# EAGLE design ster_pnp_npn (EAGLE 4.13)
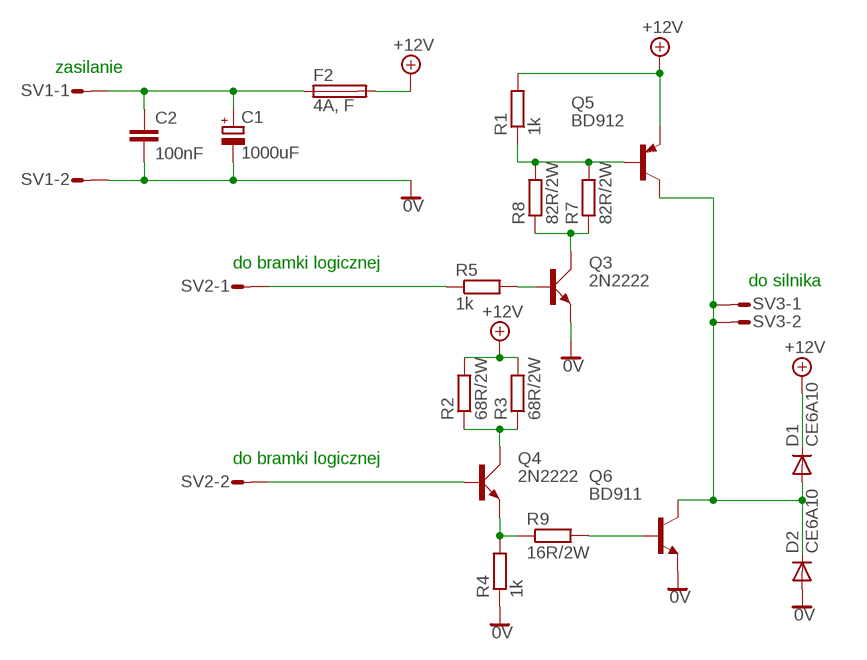
[diagram p0: schematic, sheet 1]

## Parts
C1  1000uF  CPOL-EUE3.5-10  [E3,5-10]
C2  100nF  C-EU050-025X075  [C050-025X075]
D1  CE6A10  BA296  [P2-15]
D2  CE6A10  BA296  [P2-15]
F2  4A, F  SH22  [SH22]
Q3  2N2222  [TO18A]
Q4  2N2222  [TO18A]
Q5  BD912  2N6107  [TO220]
Q6  BD911  2N6292  [TO220]
R1  1k  R-EU_0204/7  [0204/7]
R2  68R/2W  R-EU_0309/12  [0309/12]
R3  68R/2W  R-EU_0309/12  [0309/12]
R4  1k  R-EU_0204/7  [0204/7]
R5  1k  R-EU_0204/7  [0204/7]
R7  82R/2W  R-EU_0309/12  [0309/12]
R8  82R/2W  R-EU_0309/12  [0309/12]
R9  16R/2W  R-EU_0309/12  [0309/12]
SV1  L02P  [L02P]
SV2  L02P  [L02P]
SV3  L02P  [L02P]

## Nets
0V: C1.- C2.2 D2.A Q3.E Q6.3(E) R4.1 SV1.2
+12V: D1.C F2.2 Q5.3(E) R1.2 R2.2 R3.2
N$1: Q5.1(B) R1.1 R7.2 R8.2
N$2: Q3.C R7.1 R8.1
N$3: D1.A D2.C Q5.2(C) Q6.2(C) SV3.1 SV3.2
N$4: C1.+ C2.1 F2.1 SV1.1
N$5: Q4.E R4.2 R9.1
N$6: Q6.1(B) R9.2
N$7: R5.1 SV2.1
N$8: Q4.B SV2.2
N$9: Q3.B R5.2
N$10: Q4.C R2.1 R3.1

## Notes on the sheet
- zasilanie
- do bramki logicznej
- do silnika
- do bramki logicznej

## Library data of the parts
C1 = rcl:CPOL-EU: POLARIZED CAPACITOR, European symbol
C2 = rcl:C-EU: CAPACITOR, European symbol
D1 D2 = diode:BA296: DIODE
F2 = fuse:SH22: FUSE HOLDER CS PFP30, Schukat
Q3 Q4 = transistor-small-signal:2N2222: NPN TRANSISTOR
Q5 = transistor-pnp:2N6107: PNP Transistor
Q6 = transistor-npn:2N6292: NPN Transistor
R1-R5 R7-R9 = rcl:R-EU_: RESISTOR, European symbol
SV1-SV3 = con-amp-mt:L02P: AMP MT CONNECTOR

## Board
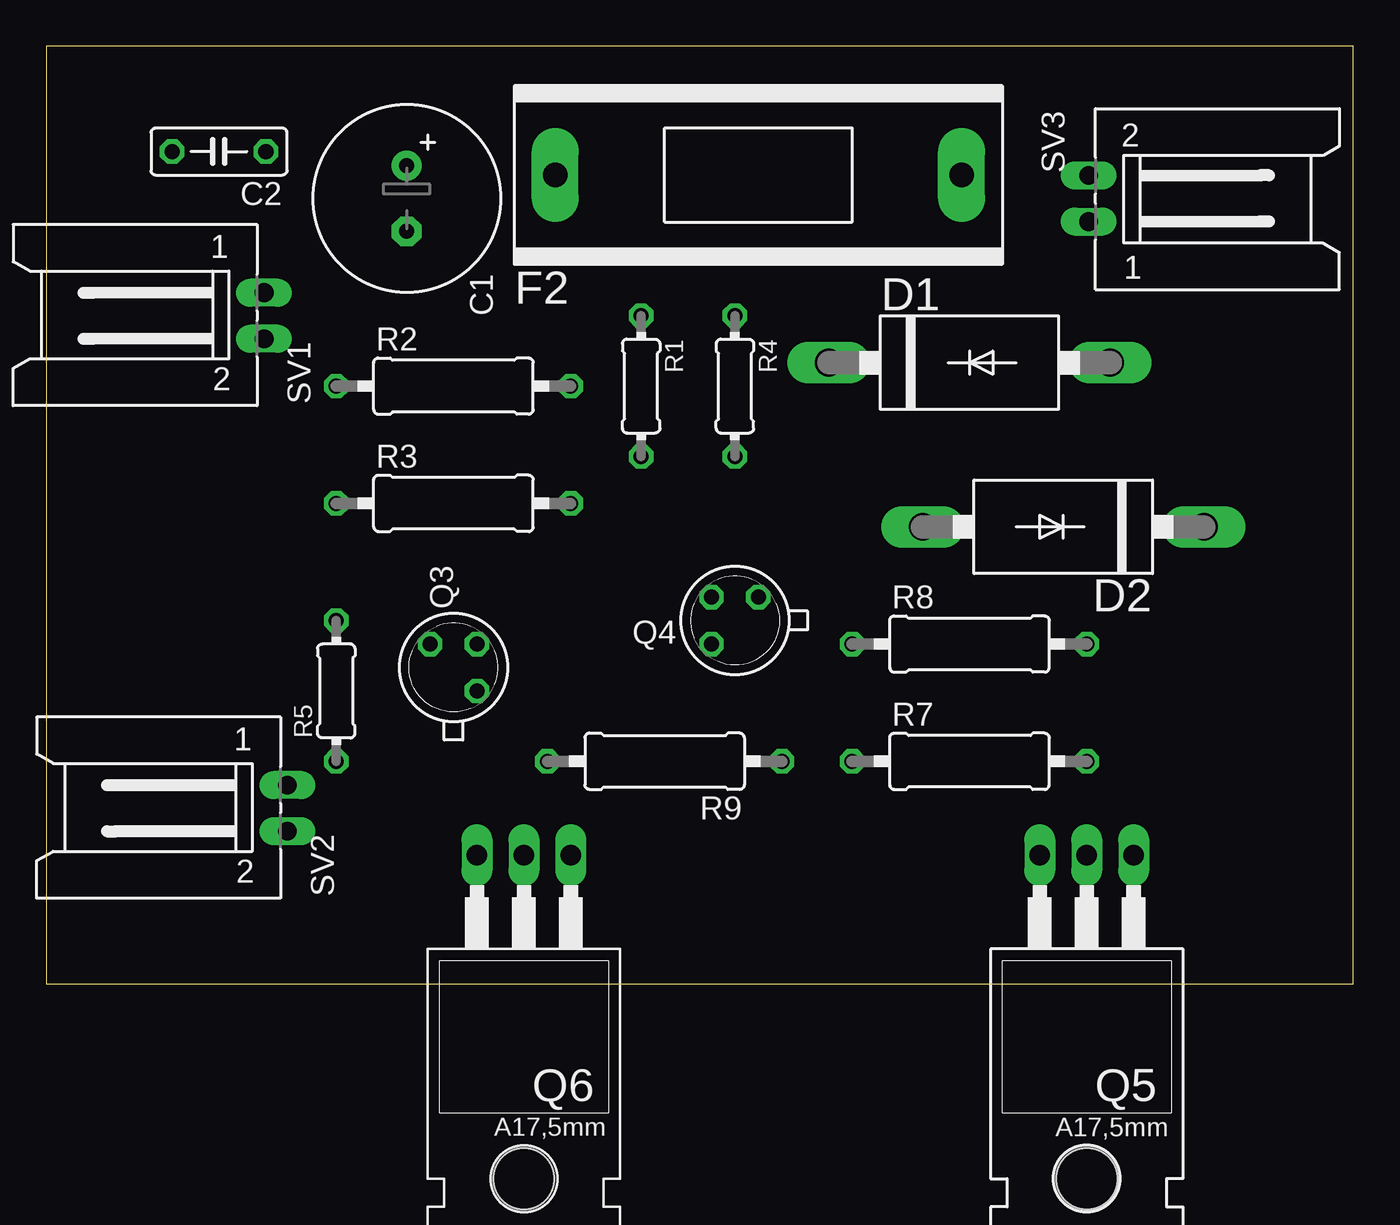
[diagram p1: board, top side]
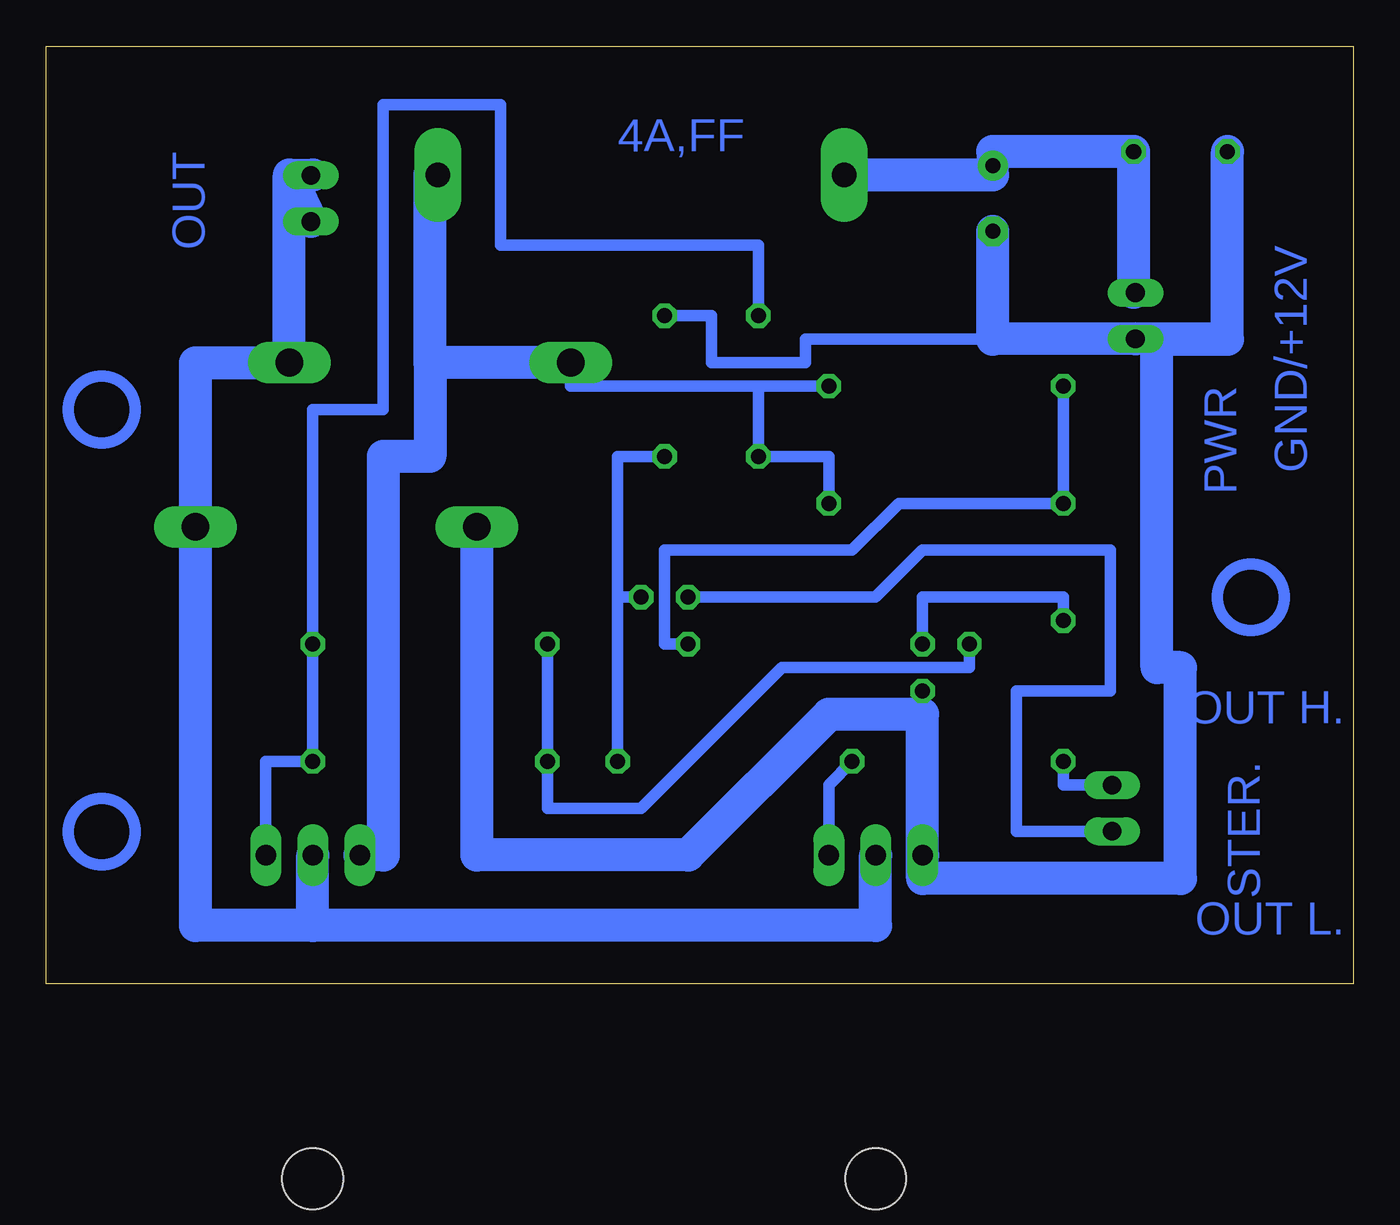
[diagram p2: board, bottom side, seen from below]

Size 70.79 x 50.79 mm. Coordinates in mm from the lower left corner, seen from the top.
Outline: 0,0 70.79,0 70.79,50.79 0,50.79 0,0
Copper layers (1*16): Top 0.035mm / dielectric 1.5mm / Bottom 0.035mm
Design rules "default": minimum track width 10mil, minimum drill 24mil, track to track 8mil, track to pad 8mil, pad to pad 8mil, via to via 8mil, smd to smd 8mil, copper to edge 40mil, drill to drill 8mil, minimum pad ring 10mil, minimum via ring 8mil, stop-mask expansion 4mil, vias tented up to drill 0mil, thermal gap 10mil

### Footprints (pad centres in the part's own frame; a part is rotated, then mirrored left to right if it is on the bottom)
E3,5-10 = drill 0.813 pad 1.6 round: + -1.778,0 | drill 0.813 pad 1.6 octagon: - 1.778,0
C050-025X075 = drill 0.813 octagon: 1 -2.54,0; 2 2.54,0
P2-15 = drill 1.499 long: A 7.62,0; C -7.62,0
SH22 = drill 1.321 pad 2.54 long: 1 -10.998,0; 2 10.998,0
TO18A = drill 0.813 octagon: B 1.27,-1.27; C 1.27,1.27; E -1.27,-1.27
TO220 = drill 1.118 long: 1 -2.54,-6.35; 2 0,-6.35; 3 2.54,-6.35 | hole 3.302: 0,11.176
0204/7 = drill 0.813 octagon: 1 -3.81,0; 2 3.81,0
0309/12 = drill 0.813 octagon: 1 -6.35,0; 2 6.35,0
L02P = drill 1.016 long: 1 1.25,-6.25; 2 -1.25,-6.25

### Placement (x,y rotation side)
C1  19.52,42.54 270 top
C2  9.36,45.08 180 top
D1  50,33.65 0 top
D2  55.08,24.76 180 top
F2  38.57,43.81 0 top
Q3  22.06,17.14 90 top
Q4  37.3,19.68 180 top
Q5  56.35,0.63 180 top
Q6  25.87,0.63 180 top
R1  32.22,32.38 270 top
R2  22.06,32.38 0 top
R3  22.06,26.03 0 top
R4  37.3,32.38 270 top
R5  15.71,15.87 90 top
R7  50,12.06 0 top
R8  50,18.41 0 top
R9  33.49,12.06 180 top
SV1  5.55,36.19 90 top
SV2  6.82,9.52 90 top
SV3  62.7,42.54 270 top

### Tracks (layer width: path | path; a pad name or v marks a point on that pad's centre or on a via)
0V
  Bottom 0.61: 23.33,14.6 Q3.E | 19.52,34.92 29.68,34.92 29.68,33.65 34.76,33.65 34.76,36.19 R4.1
  Bottom 1.778: D2.A 47.46,6.98 36.03,6.98 28.41,14.6 23.33,14.6 Q6.3 23.33,5.71 9.36,5.71 9.36,17.14 10.63,17.14 10.63,34.92 6.82,34.92 | 6.82,34.92 C2.2 | C1.- 19.52,34.92 SV1.2 6.82,34.92
+12V
  Bottom 0.61: 32.22,32.38 R1.2 28.41,28.57 R3.2 | 32.22,32.38 42.38,32.38 D1.C | 32.22,32.38 R2.2
  Bottom 1.778: 50,33.65 50,28.57 52.54,28.57 52.54,6.98 Q5.3 | D1.C 50,33.65 | 50,33.65 50,43.81 F2.2
N$1
  Bottom 0.61: Q5.1 58.89,12.06 R7.2 R8.2 56.35,31.11 52.54,31.11 52.54,47.62 46.19,47.62 46.19,40 32.22,40 R1.1
N$2
  Bottom 0.61: R8.1 R7.1 43.65,9.52 38.57,9.52 30.95,17.14 20.79,17.14 Q3.C
N$3
  Bottom 0.254: 56.35,43.81 SV3.2
  Bottom 1.778: 56.35,3.17 25.87,3.17 Q6.2 | 57.62,43.81 56.35,43.81 | 57.62,43.81 D1.A 62.7,33.65 D2.C 62.7,3.17 56.35,3.17 | 57.62,43.81 SV3.1 | 56.35,3.17 Q5.2
N$4
  Bottom 0.254: C1.+ 19.52,43.81 | SV1.1 11.9,37.46
  Bottom 1.778: C1.+ 19.52,45.08 C2.1 11.9,37.46 | 19.52,43.81 F2.1
N$5
  Bottom 0.61: R9.1 39.84,20.95 | R4.2 39.84,28.57 39.84,20.95 | 39.84,20.95 Q4.E
N$6
  Bottom 0.61: R9.2 28.41,10.79 Q6.1
N$7
  Bottom 0.61: R5.1 15.71,10.79 SV2.1
N$8
  Bottom 0.61: Q4.B 25.87,20.95 23.33,23.49 13.17,23.49 13.17,15.87 18.25,15.87 18.25,8.25 13.17,8.25 SV2.2
N$9
  Bottom 0.61: Q3.B 23.33,20.95 15.71,20.95 R5.2
N$10
  Bottom 0.61: R2.1 R3.1 24.6,26.03 27.14,23.49 37.3,23.49 37.3,18.41 Q4.C
(copper drawn outside any net)
  shapes: Bottom circle x3

### Text on the board
Bottom: 4A,FF | OUT | GND/+12V | PWR | OUT H. | STER. | OUT L.